# EAGLE design Teensy-Maxuino-Slave-A4988-stepper 2x shield (EAGLE 6.4)
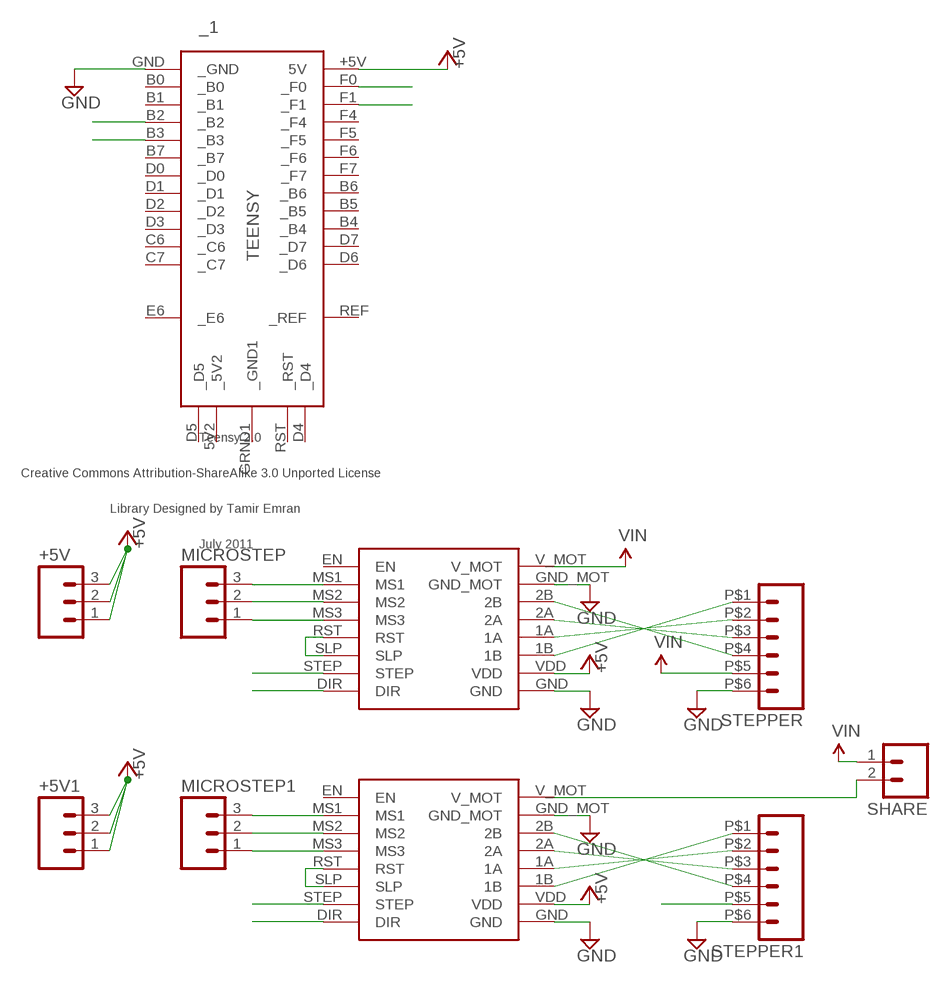
[diagram p0: schematic, sheet 1]

## Parts
+5V  M03PTH  [1X03]
+5V1  M03PTH  [1X03]
_1  TEENSY  [TEENSY]
A4988_1  POLOLU_A4988  [POLOLU_A4988]
A4988_2  POLOLU_A4988  [POLOLU_A4988]
MICROSTEP  M03PTH  [1X03]
MICROSTEP1  M03PTH  [1X03]
SHARE  M02PTH  [1X02]
STEPPER  M06  [SPRINGTERMINAL-2.54MM-6]
STEPPER1  M06  [SPRINGTERMINAL-2.54MM-6]

## Nets
+5V: +5V1.1 +5V1.2 +5V1.3 +5V.1 +5V.2 +5V.3 _1.+5V(5V) A4988_1.VDD A4988_2.VDD
DIR: _1.F0(_F0) A4988_1.DIR
DIR1: _1.B3(_B3) A4988_2.DIR
GND [GND]: _1.GND(_GND) A4988_1.GND A4988_1.GND_MOT A4988_2.GND A4988_2.GND_MOT STEPPER1.P$6 STEPPER.P$6
N$1 [Power]: A4988_1.2B STEPPER.P$4
N$2 [Power]: A4988_1.2A STEPPER.P$3
N$3 [Power]: A4988_1.1A STEPPER.P$2
N$4 [Power]: A4988_1.1B STEPPER.P$1
N$5: A4988_2.RST A4988_2.SLP
N$6: A4988_1.RST A4988_1.SLP
N$7: A4988_2.MS1 MICROSTEP1.3
N$8: A4988_1.MS1 MICROSTEP.3
N$9: A4988_1.MS2 MICROSTEP.2
N$10: A4988_1.MS3 MICROSTEP.1
N$11: A4988_2.MS2 MICROSTEP1.2
N$12: A4988_2.MS3 MICROSTEP1.1
N$13: A4988_2.2B STEPPER1.P$4
N$14 [Power]: A4988_2.2A STEPPER1.P$3
N$15 [Power]: A4988_2.1A STEPPER1.P$2
N$16 [Power]: A4988_2.1B STEPPER1.P$1
STEP: _1.F1(_F1) A4988_1.STEP
STEP1: _1.B2(_B2) A4988_2.STEP
VIN [Power]: A4988_1.V_MOT SHARE.1 STEPPER.P$5
VIN_2 [Power]: A4988_2.V_MOT SHARE.2 STEPPER1.P$5
Unconnected: _1.5V2(_5V2) _1.B0(_B0) _1.B1(_B1) _1.B4(_B4) _1.B5(_B5) _1.B6(_B6) _1.B7(_B7) _1.C6(_C6) _1.C7(_C7) _1.D0(_D0) _1.D1(_D1) _1.D2(_D2) _1.D3(_D3) _1.D4(_D4) _1.D5(_D5) _1.D6(_D6) _1.D7(_D7) _1.E6(_E6) _1.F4(_F4) _1.F5(_F5) _1.F6(_F6) _1.F7(_F7) _1.GRND1(_GND1) _1.REF(_REF) _1.RST(_RST) A4988_1.EN A4988_2.EN

## Library data of the parts
+5V +5V1 MICROSTEP MICROSTEP1 = SparkFun-Connectors:M03: Header 3 Standard 3-pin 0.1" header. Use with straight break away headers (SKU : PRT-00116), right angle break away headers (PRT-00553), swiss pins (PRT-00743), machine pins (PRT-00117), and female headers (PRT-00115). Molex polarized connector foot print use with SKU : PRT-08232 with associated crimp pins and housings.
_1 = aliEagleLib:TEENSY: Teensy 2.0 Original Design by Clint Fisher Modified Design by Tamir Emran Licensed Under Creative Commons Attribution-ShareAlike 3.0 Unported (CC BY-SA 3.0)
A4988_1 A4988_2 = aliEagleLib:POLOLU_A4988
SHARE = SparkFun-Connectors:M02: Header 2 Standard 2-pin 0.1" header. Use with straight break away headers (SKU : PRT-00116), right angle break away headers (PRT-00553), swiss pins (PRT-00743), machine pins (PRT-00117), and female headers (PRT-00115). Molex polarized connector foot print use with SKU : PRT-08233 with associated crimp pins and housings.
STEPPER STEPPER1 = aliEagleLib:M06: Header 6 Standard 6-pin 0.1" header. Use with straight break away headers (SKU : PRT-00116), right angle break away headers (PRT-00553), swiss pins (PRT-00743), machine pins (PRT-00117), and female headers (PRT-00115). Molex polarized connector foot print use with SKU : PRT-08094 with associated crimp pins and housings. NOTES ON THE VARIANTS LOCK and LOCK_LONGPADS... This footprint was designed to help hold the alignment of a through-hole component (i.e. 6-pin header) while soldering it into place. You may notice that each hole has been shifted either up or down by 0.005 of an inch from it's more standard position (which is a perfectly straight line). This slight alteration caused the pins (the squares in the middle) to touch the edges of the holes. Because they are alternating, it causes a "brace" to hold the component in place. 0.005 has proven to be the perfect amount of "off-center" position when using our standard breakaway headers. Although looks a little odd when you look at the bare footprint, once you have a header in there, the alteration is very hard to notice. Also, if you push a header all the way into place, it is covered up entirely on the bottom side. This idea of altering the position of holes to aid alignment will be further integrated into the Sparkfun Library for other footprints. It can help hold any component with 3 or more connection pins.

## Net classes
0 default: width 0.152 mm, clearance 0.152 mm
1 GND: width 0.406 mm, clearance 0.152 mm
2 Power: width 0.406 mm, clearance 0.152 mm

## Board
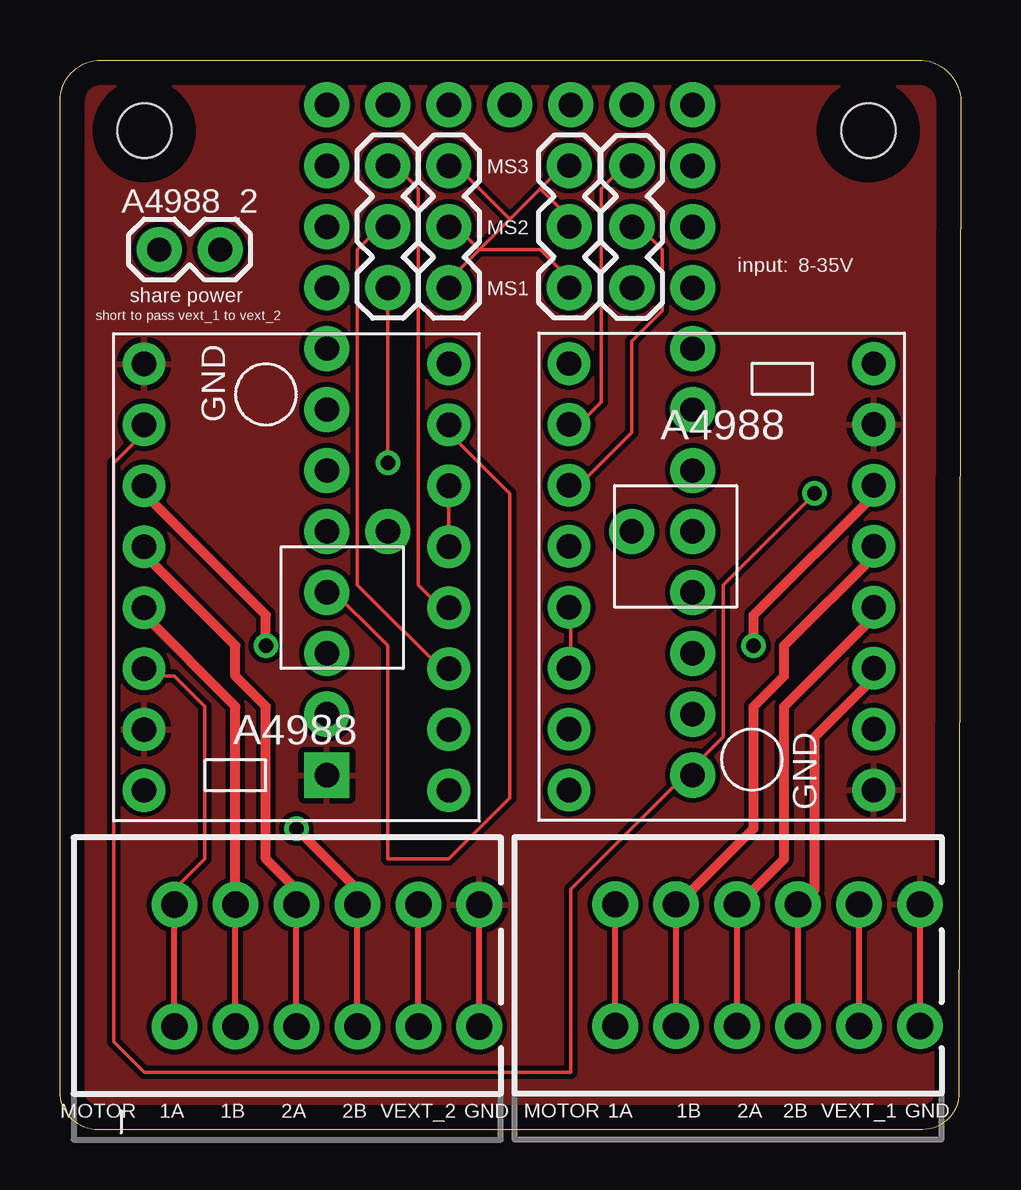
[diagram p1: board, top side]
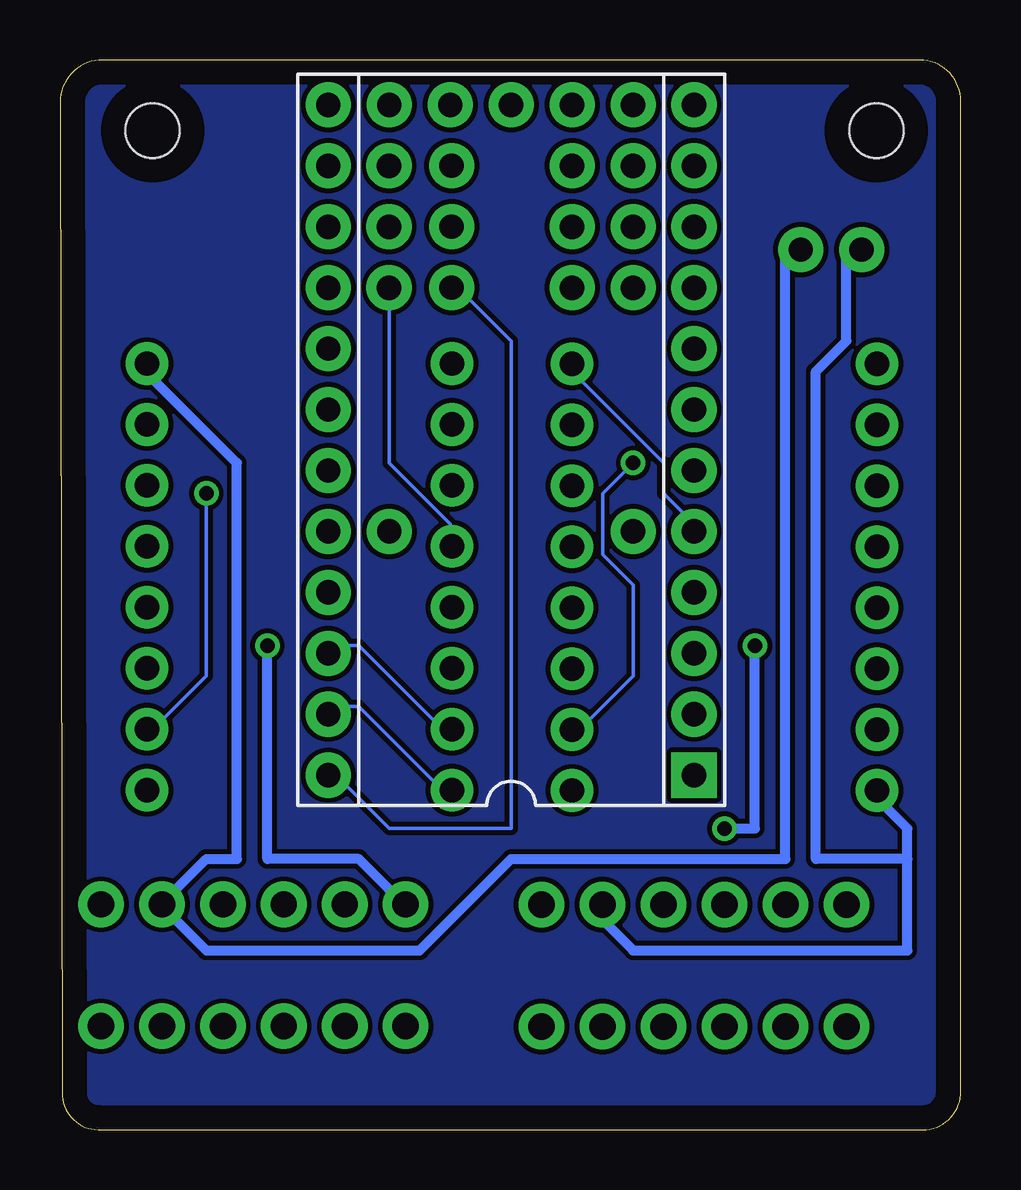
[diagram p2: board, bottom side, seen from below]

Size 37.54 x 44.59 mm. Coordinates in mm from the lower left corner, seen from the top.
Outline: 0.01,1.76 0.01,42.88 arc-90 1.71,44.59 35.92,44.59 arc-90 37.53,42.67 37.45,1.54 arc-90 35.95,0 1.44,0 arc-90 0.01,1.76
Copper layers (1*16): Top 0.035mm / dielectric 1.5mm / Bottom 0.035mm
Design rules "default *": minimum track width 6mil, minimum drill 24mil, track to track 8mil, track to pad 8mil, pad to pad 8mil, via to via 8mil, smd to smd 8mil, copper to edge 40mil, drill to drill 6mil, minimum pad ring 10mil, minimum via ring 8mil, stop-mask expansion 4mil, vias tented up to drill 0mil, thermal gap 10mil
Holes 2.26 mm at 3.52,41.64 33.68,41.64

### Footprints (pad centres in the part's own frame; a part is rotated, then mirrored left to right if it is on the bottom)
1X03 = drill 1.016 pad 1.88: 1 0,0; 2 2.54,0; 3 5.08,0
TEENSY = drill 1.016 pad 1.88: 5V2 13.97,-2.54; +5V -13.97,7.62; B0 -11.43,-7.62; B1 -8.89,-7.62; B2 -6.35,-7.62; B3 -3.81,-7.62; B4 8.89,7.62; B5 6.35,7.62; B6 3.81,7.62; B7 -1.27,-7.62; C6 11.43,-7.62; C7 13.97,-7.62; D0 1.27,-7.62; D1 3.81,-7.62; D2 6.35,-7.62; D3 8.89,-7.62; D4 13.97,5.08; D5 13.97,-5.08; D6 13.97,7.62; D7 11.43,7.62; E6 -3.81,-5.08; F0 -11.43,7.62; F1 -8.89,7.62; F4 -6.35,7.62; F5 -3.81,7.62; F6 -1.27,7.62; F7 1.27,7.62; GRND1 13.97,0; REF -3.81,5.08; RST 13.97,2.54 | drill 1.016 pad 1.88 square: GND -13.97,-7.62
POLOLU_A4988 = drill 1.016 pad 1.778: 1A 6.35,-1.27; 1B 6.35,-3.81; 2A 6.35,1.27; 2B 6.35,3.81; DIR -6.35,-8.89; EN -6.35,8.89; GND 6.35,-8.89; GND_MOT 6.35,6.35; MS1 -6.35,6.35; MS2 -6.35,3.81; MS3 -6.35,1.27; RST -6.35,-1.27; SLP -6.35,-3.81; STEP -6.35,-6.35; V_MOT 6.35,8.89; VDD 6.35,-6.35
1X02 = drill 1.016 pad 1.88: 1 0,0; 2 2.54,0
SPRINGTERMINAL-2.54MM-6 = drill 1.1 pad 1.9: 1 2.54,-2.54; 2 0,-2.54; 3 -2.54,-2.54; 4 -5.08,-2.54; 5 5.08,-2.54; 6 7.62,-2.54; P$1 2.54,2.54; P$2 0,2.54; P$3 -2.54,2.54; P$4 -5.08,2.54; P$5 5.08,2.54; P$6 7.62,2.54

### Placement (x,y rotation side)
+5V  21.22,40.18 270 top
+5V1  16.2,40.18 270 top
_1  18.74,28.75 90 bottom
A4988_1  27.56,23.04 0 top
A4988_2  9.85,23.03 180 top
MICROSTEP  23.83,35.1 90 top
MICROSTEP1  13.66,40.18 270 top
SHARE  6.68,36.68 180 top
STEPPER  28.21,6.85 0 top
STEPPER1  9.85,6.84 0 top

### Tracks (layer width: path | path; a pad name or v marks a point on that pad's centre or on a via)
"+5V"
  pour Bottom: 37.16,44.3 37.16,0.49 0.96,0.49 0.96,44.3 2.23,44.3
+5V  (via drill 0.61)
  Top 0.152: 20.01,39.22 21.28,40.49 +5V.1 | 20.01,39.22 18.74,37.95 | 18.74,37.95 17.47,36.68 | 17.47,36.68 16.2,35.41 +5V1.3 | 17.47,36.68 16.2,37.95 +5V1.2 | 17.47,36.68 20.01,36.68 21.28,35.41 +5V.3 | 20.01,39.22 21.28,37.95 +5V.2 | 18.74,37.95 16.2,40.49 +5V1.1 | 26.36,15.09 21.28,10.01 21.28,2.39 3.5,2.39 2.23,3.66 2.23,27.79 3.5,29.06 A4988_2.VDD | v31.44,26.52 27.63,22.71 27.63,16.36 26.36,15.09 | 26.36,15.09 _1.+5V
  Bottom 0.152: v31.44,26.52 31.44,18.9 33.98,16.36 A4988_1.VDD | +5V.3 21.28,35.41 18.74,32.87 18.74,12.55 23.82,12.55 26.36,15.09 _1.+5V
DIR
  Bottom 0.152: A4988_1.DIR 21.28,13.82 25.09,17.63 26.36,17.63 _1.F0
DIR1
  Bottom 0.152: A4988_2.DIR 16.2,31.6 12.39,27.79 12.39,26.52 11.12,25.25 _1.B3
GND
  pour Top: 0.35,2.81 arc90 1.8,0.44 36.25,0.44 arc90 37.05,1.68 37.34,42.89 arc90 35.47,44.13 0.41,44.16
N$1  (via drill 0.61)
  Top 0.406: v28.9,20.17 28.9,21.44 33.98,26.52 A4988_1.2B
  Bottom 0.406: v28.9,20.17 28.9,11.28 25.09,11.28 23.82,10.01 STEPPER.P$4
N$2
  Top 0.406: A4988_1.2A 33.98,23.98 30.17,20.17 30.17,18.9 28.9,17.63 28.9,12.55 26.36,10.01 STEPPER.P$3
N$3
  Top 0.406: A4988_1.1A 33.98,21.44 30.17,17.63 30.17,11.28 28.9,10.01 STEPPER.P$2
N$4
  Top 0.406: A4988_1.1B 33.98,18.9 31.44,16.36 31.44,10.01 STEPPER.P$1
N$5
  Top 0.152: A4988_2.RST 16.2,23.98 16.2,26.52 A4988_2.SLP
N$6
  Top 0.152: A4988_1.SLP 21.28,18.9 21.28,21.44 A4988_1.RST
N$7  (via drill 0.61)
  Top 0.152: v13.66,27.79 MICROSTEP1.3 13.66,35.41
  Bottom 0.152: v13.66,27.79 14.93,26.52 14.93,23.98 13.66,22.71 13.66,18.9 16.2,16.36 A4988_2.MS1
N$8
  Top 0.152: A4988_1.MS1 21.28,29.06 22.55,30.33 22.55,39.22 23.82,40.49 MICROSTEP.3
N$9
  Top 0.152: A4988_1.MS2 21.28,26.52 23.82,29.06 23.82,32.87 25.09,34.14 25.09,36.68 23.82,37.95 MICROSTEP.2
N$10
  Bottom 0.152: A4988_1.MS3 21.28,23.98 21.28,25.25 23.82,27.79 23.82,35.41 MICROSTEP.1
N$11
  Top 0.152: A4988_2.MS2 16.2,18.9 12.39,22.71 12.39,36.68 13.66,37.95 MICROSTEP1.2
N$12
  Top 0.152: A4988_2.MS3 16.2,21.44 14.93,22.71 14.93,39.22 13.66,40.49 MICROSTEP1.1
N$13
  Top 0.152: A4988_2.2B 3.5,18.9 4.77,18.9 6.04,17.63 6.04,11.28 4.77,10.01 STEPPER1.P$4
N$14
  Top 0.406: STEPPER1.P$3 7.31,17.63 3.5,21.44 A4988_2.2A
N$15
  Top 0.406: A4988_2.1A 3.5,23.98 7.31,20.17 7.31,18.9 8.58,17.63 8.58,11.28 9.85,10.01 STEPPER1.P$2
N$16  (via drill 0.61)
  Top 0.406: v8.58,20.17 8.58,21.44 3.5,26.52 A4988_2.1B | v9.85,12.55 12.39,10.01 STEPPER1.P$1
  Bottom 0.406: v8.58,20.17 8.58,12.55 v9.85,12.55
STEP
  Bottom 0.152: A4988_1.STEP 21.28,16.36 25.09,20.17 26.36,20.17 _1.F1
STEP1
  Top 0.152: A4988_2.STEP 16.2,29.06 18.74,26.52 18.74,13.82 16.2,11.28 13.66,11.28 13.66,20.17 11.12,22.71 _1.B2
VIN
  Bottom 0.406: A4988_1.V_MOT 33.98,31.6 30.17,27.79 30.17,11.28 31.44,11.28 32.71,10.01 STEPPER.P$5 32.71,8.74 31.44,7.47 22.55,7.47 18.74,11.28 7.31,11.28 7.31,36.68 SHARE.1
VIN_2
  Bottom 0.406: 2.23,11.28 2.23,7.47 13.66,7.47 14.93,8.74 STEPPER1.P$5 | 2.23,11.28 2.23,12.55 3.5,13.82 A4988_2.V_MOT | 2.23,11.28 6.04,11.28 6.04,31.6 4.77,32.87 4.77,36.68 SHARE.2